# EAGLE design babyGroot (EAGLE 8.2.0)
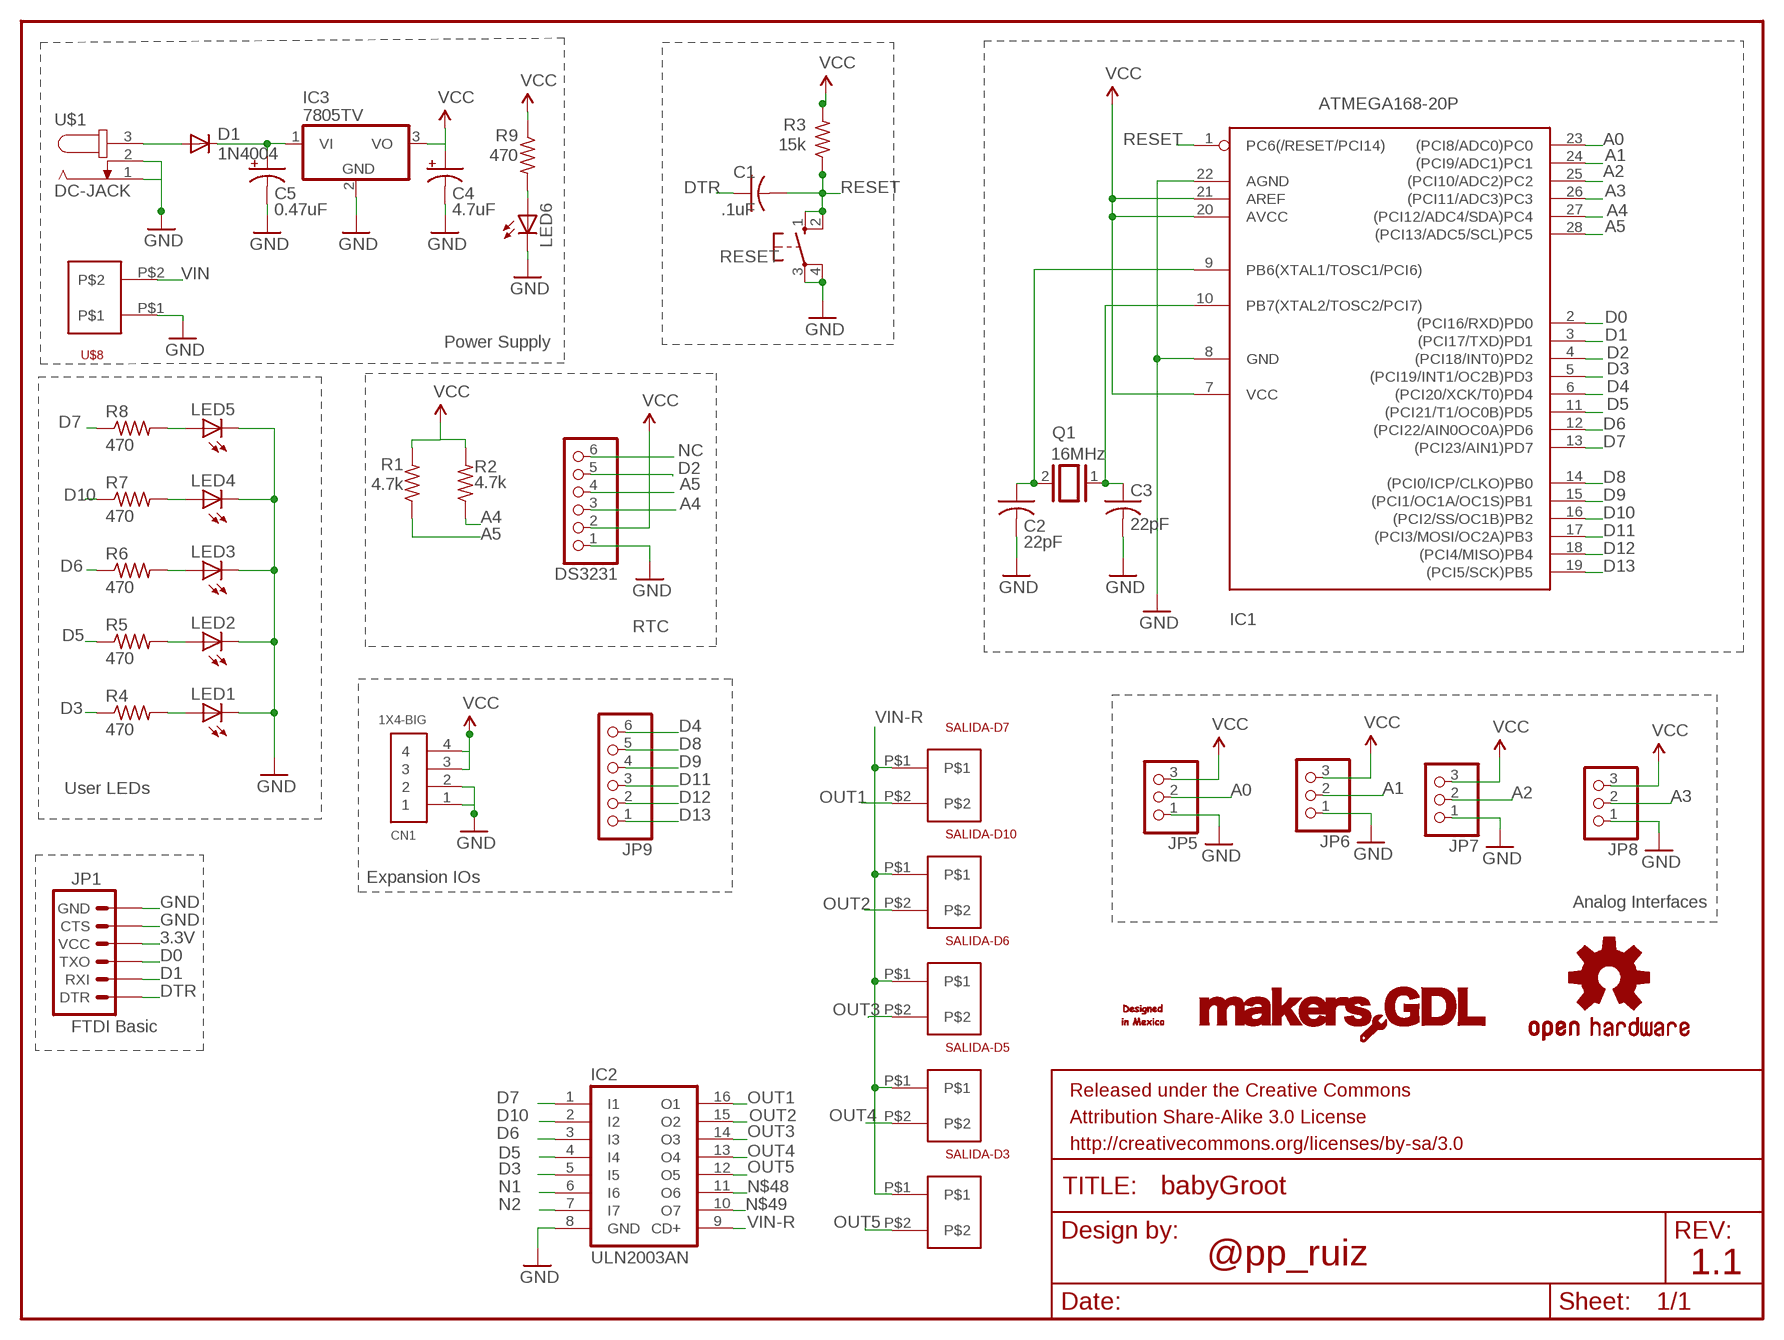
[diagram p0: schematic, sheet 1]

## Parts
C1  .1uF  C-US025-024X044  [C025-024X044]
C2  22pF  C-US025-024X044  [C025-024X044]
C3  22pF  C-US025-024X044  [C025-024X044]
C4  4.7uF  CPOL-USE2,5-6E  [E2,5-6E]
C5  0.47uF  CPOL-USE2,5-6E  [E2,5-6E]
CN1  1X4-BIG  [1X04-BIG]
D1  1N4004  [DO41-10]
DS3231  PINHD-1X6  [1X06]
FRAME1  FRAME-LETTER  [CREATIVE_COMMONS]
IC1  ATMEGA168-20P  [DIL28-3]
IC2  ULN2003AN  [DIL16]
IC3  7805TV  [TO220V]
JP1  FTDI Basic  ARDUINO_SERIAL_PROGRAMPTH  [1X06]
JP5  PINHD-1X3  [1X03]
JP6  PINHD-1X3  [1X03]
JP7  PINHD-1X3  [1X03]
JP8  PINHD-1X3  [1X03]
JP9  PINHD-1X6  [1X06]
LED1  LED3MM  [LED3MM]
LED2  LED3MM  [LED3MM]
LED3  LED3MM  [LED3MM]
LED4  LED3MM  [LED3MM]
LED5  LED3MM  [LED3MM]
LED6  LED3MM  [LED3MM]
Q1  16MHz  XTAL/S  [QS]
R1  4.7k  R-US_0204/2V  [0204V]
R2  4.7k  R-US_0204/2V  [0204V]
R3  15k  R-US_0204/2V  [0204V]
R4  470  R-US_0204/2V  [0204V]
R5  470  R-US_0204/2V  [0204V]
R6  470  R-US_0204/2V  [0204V]
R7  470  R-US_0204/2V  [0204V]
R8  470  R-US_0204/2V  [0204V]
R9  470  R-US_0204/2V  [0204V]
RESET  10-XX  [B3F-10XX]
SALIDA-D3  2POSHEADER-0.5MM  [2PIN-0.5MM]
SALIDA-D5  2POSHEADER-0.5MM  [2PIN-0.5MM]
SALIDA-D6  2POSHEADER-0.5MM  [2PIN-0.5MM]
SALIDA-D7  2POSHEADER-0.5MM  [2PIN-0.5MM]
SALIDA-D10  2POSHEADER-0.5MM  [2PIN-0.5MM]
U$1  DC-JACK  [SPC4078]
U$2  MAKERSGDLLOGO-SMALL  [MAKERSGGL-SMALL]
U$3  OSHW-LOGOS  [OSHW-LOGO-S]
U$4  MAKERSGDLLOGO-SMALL  [MAKERSGGL-SMALL]
U$5  OSHW-LOGOS  [OSHW-LOGO-S]
U$6  DESIGNEDMEXICO  [DESIGNEDMEXICO]
U$8  2POSHEADER-0.5MM  [2PIN-0.5MM]

## Nets
3.3V: C4.+ CN1.3 CN1.4 DS3231.2 IC1.7(VCC) IC1.20(AVCC) IC1.21(AREF) IC3.3(VO) JP1.4(VCC) JP5.3 JP6.3 JP7.3 JP8.3 R1.2 R2.2 R3.2 R9.1 ; supply symbol labelled VCC
A0: IC1.23((PCI8/ADC0)PC0) JP5.2
A1: IC1.24((PCI9/ADC1)PC1) JP6.2
A2: IC1.25((PCI10/ADC2)PC2) JP7.2
A3: IC1.26((PCI11/ADC3)PC3) JP8.2
A4: DS3231.3 IC1.27((PCI12/ADC4/SDA)PC4) R2.1
A5: DS3231.4 IC1.28((PCI13/ADC5/SCL)PC5) R1.1
D0: IC1.2((PCI16/RXD)PD0) JP1.3(TXO)
D1: IC1.3((PCI17/TXD)PD1) JP1.2(RXI)
D2: DS3231.5 IC1.4((PCI18/INT0)PD2)
D3: IC1.5((PCI19/INT1/OC2B)PD3) IC2.5(I5) R4.1
D4: IC1.6((PCI20/XCK/T0)PD4) JP9.6
D5: IC1.11((PCI21/T1/OC0B)PD5) IC2.4(I4) R5.1
D6: IC1.12((PCI22/AIN0OC0A)PD6) IC2.3(I3) R6.1
D7: IC1.13((PCI23/AIN1)PD7) IC2.1(I1) R8.1
D8: IC1.14((PCI0/ICP/CLKO)PB0) JP9.5
D9: IC1.15((PCI1/OC1A/OC1S)PB1) JP9.4
D10: IC1.16((PCI2/SS/OC1B)PB2) IC2.2(I2) R7.1
D11: IC1.17((PCI3/MOSI/OC2A)PB3) JP9.3
D12: IC1.18((PCI4/MISO)PB4) JP9.2
D13: IC1.19((PCI5/SCK)PB5) JP9.1
DTR: C1.1 JP1.1(DTR)
GND: C2.2 C3.2 C4.- C5.- CN1.1 CN1.2 DS3231.1 IC1.8(GND) IC1.22(AGND) IC2.8(GND) IC3.2(GND) JP1.5(CTS) JP1.6(GND) JP5.1 JP6.1 JP7.1 JP8.1 LED1.K(C) LED2.K(C) LED3.K(C) LED4.K(C) LED5.K(C) LED6.K(C) RESET.3(P) RESET.4(P1) U$1.1 U$1.2 U$8.P$1
N1: IC2.6(I6)
N2: IC2.7(I7)
N$1: C2.1 IC1.9(PB6(XTAL1/TOSC1/PCI6)) Q1.2
N$2: C3.1 IC1.10(PB7(XTAL2/TOSC2/PCI7)) Q1.1
N$3: LED6.A R9.2
N$5: LED5.A R8.2
N$8: LED4.A R7.2
N$10: LED3.A R6.2
N$12: LED2.A R5.2
N$14: LED1.A R4.2
N$48: IC2.11(O6)
N$49: IC2.10(O7)
NC: DS3231.6
OUT1: IC2.16(O1) SALIDA-D7.P$2
OUT2: IC2.15(O2) SALIDA-D10.P$2
OUT3: IC2.14(O3) SALIDA-D6.P$2
OUT4: IC2.13(O4) SALIDA-D5.P$2
OUT5: IC2.12(O5) SALIDA-D3.P$2
RESET: C1.2 IC1.1(PC6(/RESET/PCI14)) R3.1 RESET.1(S) RESET.2(S1)
VIN: D1.A U$1.3 U$8.P$2
VIN-R: C5.+ D1.C IC2.9(CD+) IC3.1(VI) SALIDA-D3.P$1 SALIDA-D5.P$1 SALIDA-D6.P$1 SALIDA-D7.P$1 SALIDA-D10.P$1

## Notes on the sheet
- Power Supply
- RTC
- User LEDs
- Expansion IOs
- Analog Interfaces
- @pp_ruiz | 1.1

## Library data of the parts
C1-C3 = adafruit:C-US: CAPACITOR, American symbol
C4 C5 = adafruit:CPOL-US: POLARIZED CAPACITOR, American symbol
CN1 = adafruit:1X4: 4-pin connector
D1 = adafruit:1N4004: DIODE General purpose 1N400x type rectifier (With bigger pads) http://www.ladyada.net/library/pcb/eaglelibrary.html
DS3231 JP9 = adafruit:PINHD-1X6: PIN HEADER
FRAME1 = SparkFun-Aesthetics:FRAME-LETTER: Schematic Frame Standard 8.5x11 US Letter frame
IC1 = adafruit:ATMEGA168*P: MICROCONTROLLER 16 kBytes FLASH 1 kBytes SRAM 512 Bytes EEPROM USART 8-channel 10 bit ADC
IC2 = uln-udn:ULN2003A: DRIVER ARRAY
IC3 = linear:78*: Positive VOLTAGE REGULATOR Source: http://cache.national.com/ds/LM/LM78L05.pdf http://www.fairchildsemi.com/ds/LM/LM7805.pdf
JP1 = SparkFun:ARDUINO_SERIAL_PROGRAM
JP5-JP8 = adafruit:PINHD-1X3: PIN HEADER
LED1-LED6 = adafruit:LED: LED OSRAM: - CHIPLED LG R971, LG N971, LY N971, LG Q971, LY Q971, LO R971, LY R971 LH N974, LH R974 LS Q976, LO Q976, LY Q976 LO Q996 - Hyper CHIPLED LW Q18S LB Q993, LB Q99A, LB R99A - SideLED LS A670, LO A670, LY A670, LG A670, LP A670 LB A673, LV A673, LT A673, LW A673 LH A674 LY A675 LS A676, LA A676, LO A676, LY A676, LW A676 LS A679, LY A679, LG A679 - Hyper Micro SIDELED® LS Y876, LA Y876, LO Y876, LY Y876 LT Y87S - SmartLED LW L88C, LW L88S LB L89C, LB L89S, LG L890 LS L89K, LO L89K, LY L89K LS L896, LA L896, LO L896, LY L896 - TOPLED LS T670, LO T670, LY T670, LG T670, LP T670 LSG T670, LSP T670, LSY T670, LOP T670, LYG T670 LG T671, LOG T671, LSG T671 LB T673, LV T673, LT T673, LW T673 LH T674 LS T676, LA T676, LO T676, LY T676, LB T676, LH T676, LSB T676, LW T676 LB T67C, LV T67C, LT T67C, LS T67K, LO T67K, LY T67K, LW E67C LS E67B, LA E67B, LO E67B, LY E67B, LB E67C, LV E67C, LT E67C LW T67C LS T679, LY T679, LG T679 LS T770, LO T770, LY T770, LG T770, LP T770 LB T773, LV T773, LT T773, LW T773 LH T774 LS E675, LA E675, LY E675, LS T675 LS T776, LA T776, LO T776, LY T776, LB T776 LHGB T686 LT T68C, LB T68C - Hyper Mini TOPLED® LB M676 - Mini TOPLED Santana® LG M470 LS M47K, LO M47K, LY M47K Source: http://www.osram.convergy.de/
Q1 = special:XTAL/S: CRYSTAL
R1-R9 = adafruit:R-US_: RESISTOR, American symbol
RESET = switch-omron:10-XX: OMRON SWITCH; MPN: B3F-1000; OC_FARNELL: 176432; OC_NEWARK: 36M3542
SALIDA-D3 SALIDA-D5-SALIDA-D7 SALIDA-D10 U$8 = StarlightMX:2POSHEADER-0.5MM
U$1 = StarlightMX:DC-JACK
U$2 U$4 = StarlightMX:MAKERSGDLLOGO-SMALL
U$3 U$5 = SparkFun:OSHW-LOGO: Open Source Hardware Logo This logo indicates the piece of hardware it is found on incorporates a OSHW license and/or adheres to the definition of open source hardware found here: http://freedomdefined.org/OSHW
U$6 = StarlightMX:DESIGNEDMEXICO

## Net classes
1 vcc: width 0.254 mm

## Board
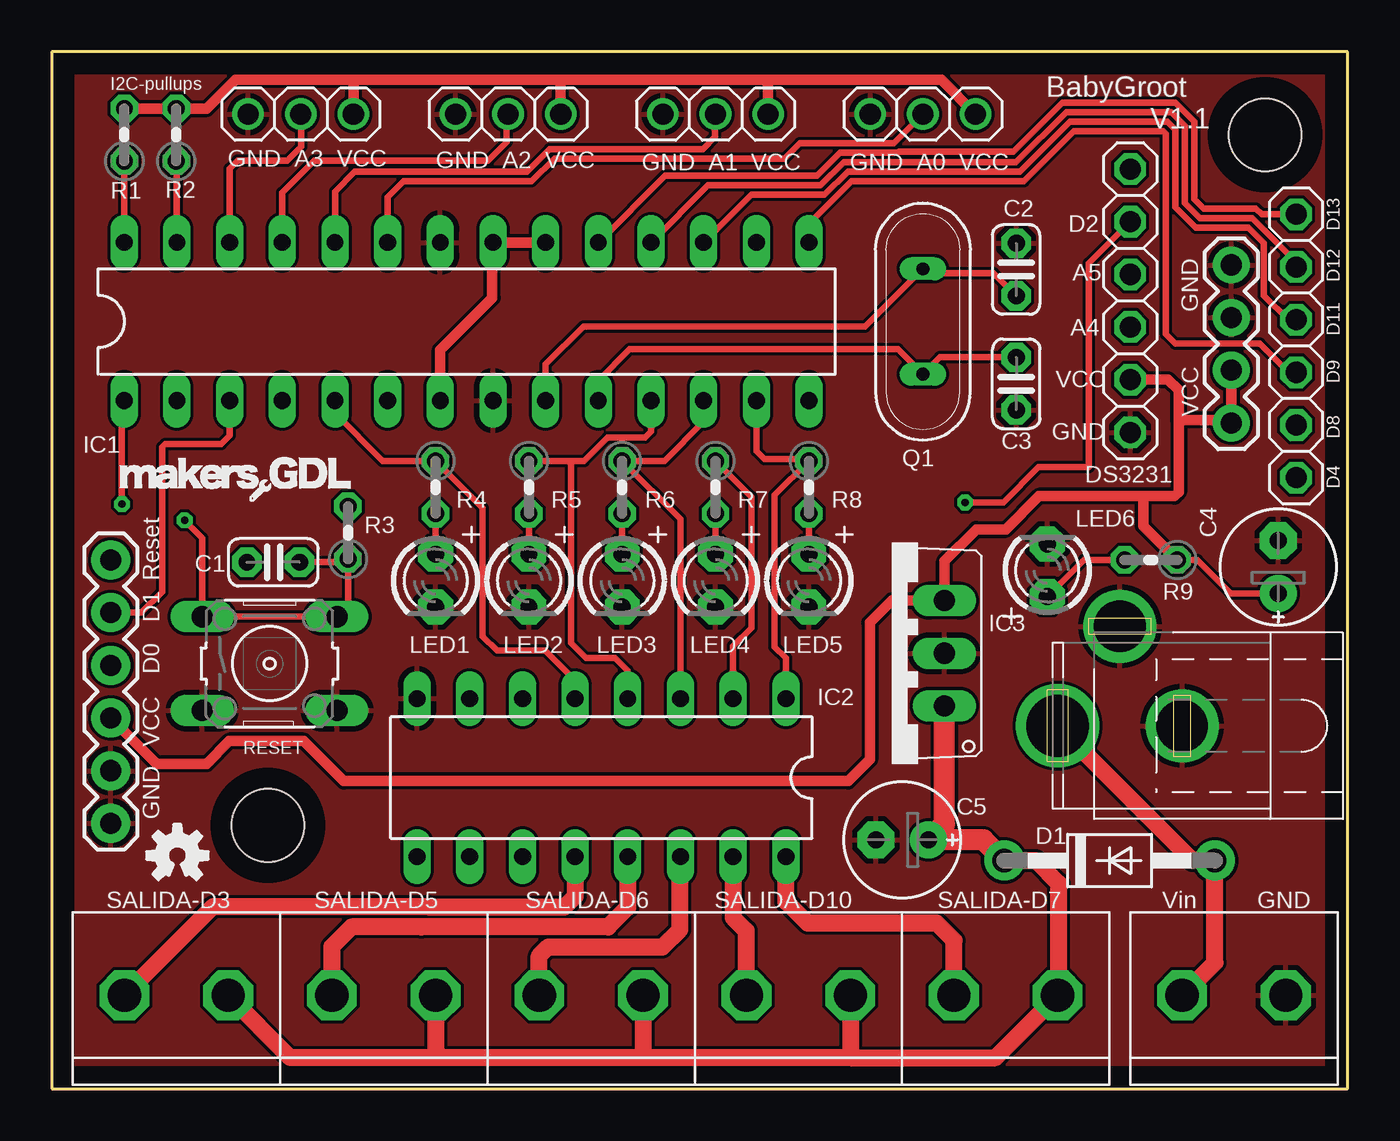
[diagram p1: board, top side]
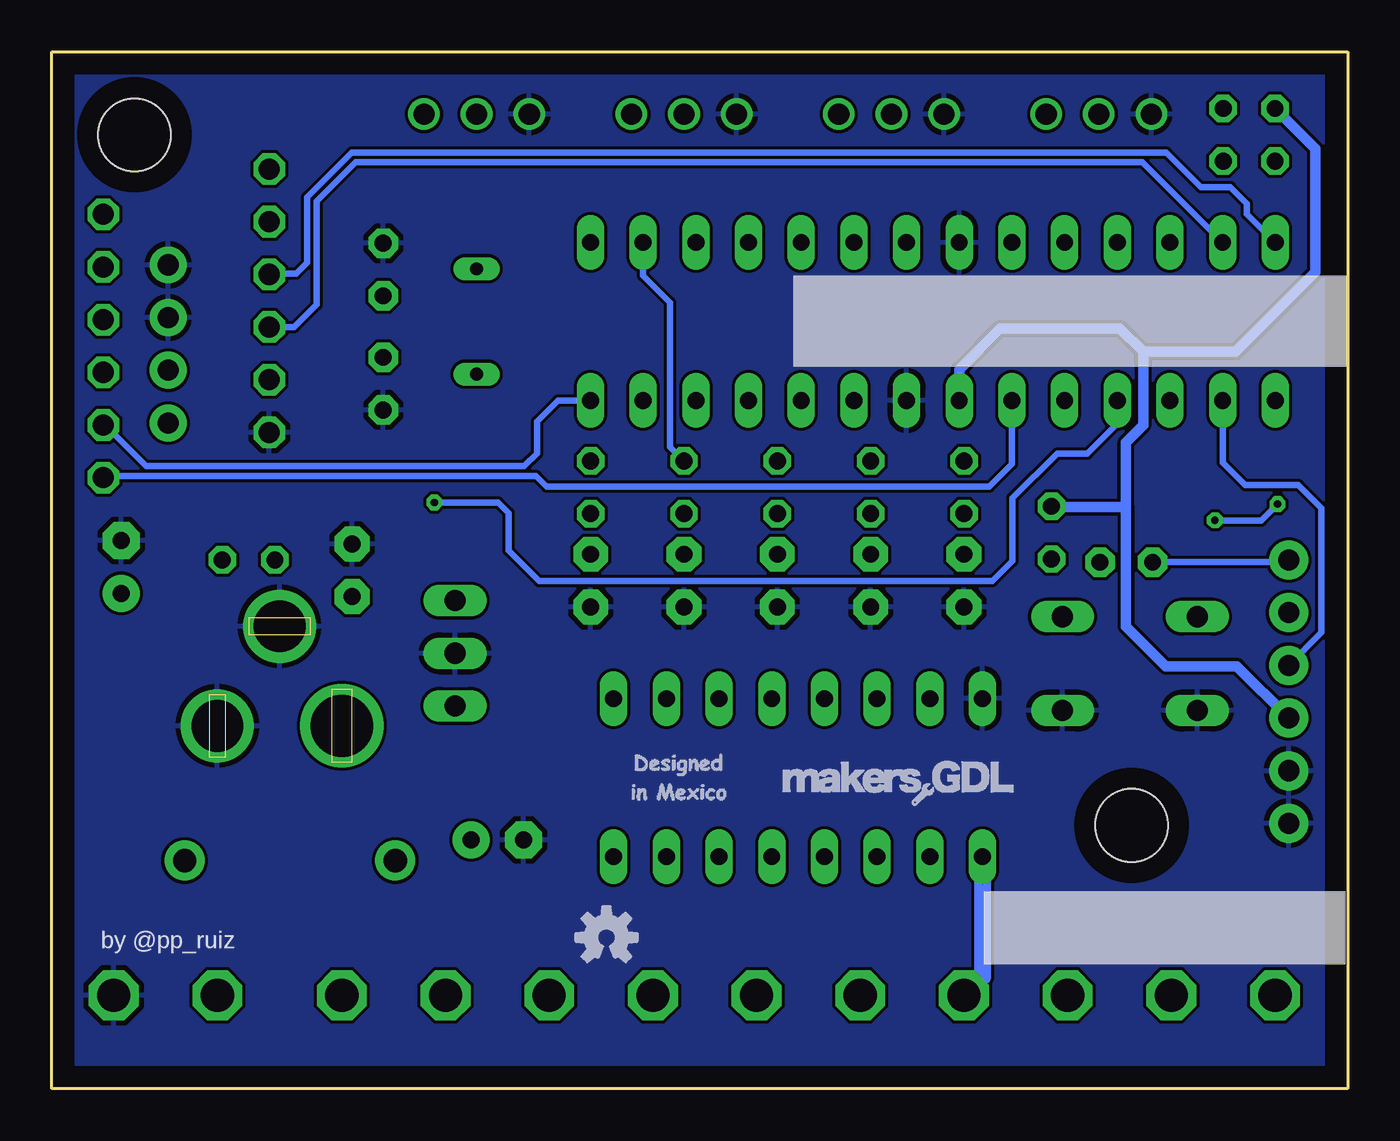
[diagram p2: board, bottom side, seen from below]

Size 62.48 x 50 mm. Coordinates in mm from the lower left corner, seen from the top.
Outline: 0,0 62.48,0 62.48,50 0,50 0,0
Copper layers (1*16): Top 0.035mm / dielectric 1.5mm / Bottom 0.035mm
Design rules "default": minimum track width 6mil, minimum drill 0.35mm, track to track 6mil, track to pad 6mil, pad to pad 6mil, via to via 6mil, smd to smd 6mil, copper to edge 40mil, drill to drill 6mil, minimum pad ring 10mil, minimum via ring 8mil, stop-mask expansion 4mil, vias tented up to drill 0mil, thermal gap 10mil
Holes 3.5 mm at 10.41,12.7 58.5,46

### Footprints (pad centres in the part's own frame; a part is rotated, then mirrored left to right if it is on the bottom)
C025-024X044 = drill 0.813 pad 1.422 octagon: 1 -1.27,0; 2 1.27,0
E2,5-6E = drill 0.813 pad 1.778: + -1.27,0 | drill 0.813 pad 1.778 octagon: - 1.27,0
1X04-BIG = drill 1.016 pad 1.778: 1 -3.81,0; 2 -1.27,0; 3 1.27,0; 4 3.81,0
DO41-10 = drill 1.118 pad 1.93: A 5.08,0; C -5.08,0
1X06 = drill 1.016 octagon: 1 -6.35,0; 2 -3.81,0; 3 -1.27,0; 4 1.27,0; 5 3.81,0; 6 6.35,0
DIL28-3 = drill 0.813 long: 1 -16.51,-3.81; 2 -13.97,-3.81; 3 -11.43,-3.81; 4 -8.89,-3.81; 5 -6.35,-3.81; 6 -3.81,-3.81; 7 -1.27,-3.81; 8 1.27,-3.81; 9 3.81,-3.81; 10 6.35,-3.81; 11 8.89,-3.81; 12 11.43,-3.81; 13 13.97,-3.81; 14 16.51,-3.81; 15 16.51,3.81; 16 13.97,3.81; 17 11.43,3.81; 18 8.89,3.81; 19 6.35,3.81; 20 3.81,3.81; 21 1.27,3.81; 22 -1.27,3.81; 23 -3.81,3.81; 24 -6.35,3.81; 25 -8.89,3.81; 26 -11.43,3.81; 27 -13.97,3.81; 28 -16.51,3.81
DIL16 = drill 0.813 long: 1 -8.89,-3.81; 2 -6.35,-3.81; 3 -3.81,-3.81; 4 -1.27,-3.81; 5 1.27,-3.81; 6 3.81,-3.81; 7 6.35,-3.81; 8 8.89,-3.81; 9 8.89,3.81; 10 6.35,3.81; 11 3.81,3.81; 12 1.27,3.81; 13 -1.27,3.81; 14 -3.81,3.81; 15 -6.35,3.81; 16 -8.89,3.81
TO220V = drill 1.016 long: 1 -2.54,-2.54; 2 0,-2.54; 3 2.54,-2.54
1X06' = drill 1.016 pad 1.88: 1 0,0; 2 2.54,0; 3 5.08,0; 4 7.62,0; 5 10.16,0; 6 12.7,0
1X03 = drill 1.016: 1 -2.54,0; 2 0,0; 3 2.54,0
LED3MM = drill 0.813 pad 1.676 octagon: A -1.27,0; K 1.27,0
QS = drill 0.61 long: 1 -2.54,0; 2 2.54,0
0204V = drill 0.813 octagon: 1 -1.27,0; 2 1.27,0
B3F-10XX = drill 1.016 long: 1 -3.251,2.261; 2 3.251,2.261; 3 -3.251,-2.261; 4 3.251,-2.261
2PIN-0.5MM = drill 1.6 octagon: P$1 -2.5,0; P$2 2.5,0
SPC4078 = drill 2.5 pad 3.5: 1 -3,0; 2 0,-4.8 | drill 3 pad 4: 3 3,0

### Placement (x,y rotation side)
C1  10.68,25.39 0 top
C2  46.5,39.5 90 top
C3  46.5,34 270 top
C4  59.13,25.16 90 top
C5  41,12 180 top
CN1  56.87,35.92 270 top
D1  51,11 0 top
DS3231  52,38 90 top
FRAME1  64.29,32.49 0 top
IC1  20,37 0 top
IC2  26.5,15 180 top
IC3  40.5,21 90 top
JP1  FTDI Basic  [1X06']  2.84,25.5 270 top
JP5  42,47 0 top
JP6  32,47 0 top
JP7  22,47 0 top
JP8  12,47 0 top
JP9  60,35.81 270 top
LED1  18.5,24.5 270 top
LED2  23,24.5 270 top
LED3  27.5,24.5 270 top
LED4  32,24.5 270 top
LED5  36.5,24.5 270 top
LED6  48,25 90 top
Q1  42,37 90 top
R1  3.5,46 90 top
R2  6,46 90 top
R3  14.28,26.81 90 top
R4  18.5,29 270 top
R5  23,29 270 top
R6  27.5,29 270 top
R7  32,29 270 top
R8  36.5,29 270 top
R9  52.99,25.5 180 top
RESET  10.5,20.5 0 top
SALIDA-D3  6,4.5 180 top
SALIDA-D5  16,4.5 180 top
SALIDA-D6  26,4.5 180 top
SALIDA-D7  46,4.5 180 top
SALIDA-D10  36,4.5 180 top
U$1  51.5,17.5 180 top
U$2  22.1,14.86 0 bottom
U$3  6.05,11.25 0 top
U$4  8.43,29.51 0 top
U$5  35.74,7.29 0 bottom
U$6  32.44,14.81 0 bottom
U$8  57,4.5 180 top

### Tracks (layer width: path | path; a pad name or v marks a point on that pad's centre or on a via)
3.3V
  Top 0.305: R9.1 55.23,25.5 56.85,23.89 C4.+
  Top 0.508: IC1.7 18.73,35.62 21.23,38.12 21.23,40.77 IC1.21 IC1.20 | R1.2 R2.2 7.47,47.27 8.85,48.65 14.61,48.65 | 24.61,48.65 34.34,48.65 | 14.61,48.65 24.61,48.65 | 34.34,48.65 42.89,48.65 JP5.3 | JP6.3 34.54,48.45 34.34,48.65 | JP7.3 24.54,48.58 24.61,48.65 | JP8.3 14.54,48.59 14.61,48.65 | JP1.4 5.05,15.67 7.47,15.67 8.56,16.76 12.14,16.76 14.07,14.83 38.41,14.83 39.45,15.88 39.45,22.48 40.51,23.54 IC3.3 43.04,25.44 44.58,26.98 46,26.98 47.6,28.57 52.63,28.57 | R9.1 52.63,27.14 52.63,28.57 | 52.63,28.57 54.13,28.57 54.33,28.78 54.33,32.23 | DS3231.2 53.82,34.19 54.33,33.68 54.33,32.23 | 54.33,32.23 56.74,32.23 CN1.4 CN1.3
  Bottom 0.508: 9.86,35.53 9.86,32 10.69,31.17 10.69,28.04 | 9.86,35.53 10.97,36.65 16.76,36.65 18.73,34.69 IC1.7 | R1.2 1.55,45.32 1.55,39.37 5.38,35.53 9.86,35.53 | JP1.4 5.34,20.37 8.76,20.37 10.69,22.3 10.69,28.04 | R3.2 14.28,28.04 10.69,28.04
A0
  Top 0.305: IC1.23 16.19,42.99 16.97,43.76 23.14,43.76 24.23,44.86 35.33,44.86 36.07,45.59 40.59,45.59 JP5.2
A1
  Top 0.305: IC1.24 13.65,43.27 14.61,44.22 22.91,44.22 24,45.31 31.39,45.31 31.98,45.9 31.98,46.98 JP6.2
A2
  Top 0.305: IC1.25 11.11,43.22 12.65,44.76 21.03,44.76 21.92,45.64 21.92,46.92 JP7.2
A3
  Top 0.305: IC1.26 8.57,44.36 8.97,44.76 11.35,44.76 12.01,45.41 12.01,46.99 JP8.2
A4
  Top 0.305: IC1.27 6.03,44.7 R2.1
  Bottom 0.305: IC1.27 9.9,44.68 47.83,44.68 49.71,42.8 49.71,37.82 50.8,36.73 DS3231.3
A5
  Top 0.305: IC1.28 R1.1
  Bottom 0.305: IC1.28 4.85,42.17 4.85,42.67 5.66,43.48 7.09,43.48 8.74,45.14 48.02,45.14 50.16,42.99 50.16,39.83 50.7,39.29 51.98,39.29 DS3231.4
D0
  Bottom 0.305: IC1.2 6.02,30.2 4.93,29.11 2.39,29.11 1.27,27.99 1.27,21.99 JP1.3
D1
  Top 0.305: JP1.2 4.31,22.96 5.31,23.95 5.31,30.94 5.46,31.09 8.15,31.09 8.57,31.51 IC1.3
D2  (via drill 0.35)
  Top 0.305: v44.04,28.27 45.87,28.27 47.57,29.97 50.01,29.97 50.01,39.82 DS3231.5
  Bottom 0.305: IC1.4 11.11,32.07 12.55,30.63 13.99,30.63 16.15,28.47 16.15,25.45 17.12,24.49 38.99,24.49 40.46,25.96 40.46,27.76 40.97,28.27 v44.04,28.27
D3
  Top 0.305: IC1.5 13.65,32.58 15.95,30.28 R4.1 20.78,27.99 20.78,21.82 21.46,21.13 23.77,21.13 25.23,19.68 IC2.5
D4
  Bottom 0.305: IC1.6 16.19,30.11 17.27,29.03 38.63,29.03 39.14,29.54 59.92,29.54 JP9.6
D5
  Top 0.305: 24.89,30.27 R5.1 | 24.89,30.27 25.67,30.27 26.8,31.39 28.6,31.39 28.89,31.68 IC1.11 | IC2.4 27.77,20.16 27.15,20.78 25.76,20.78 25.04,21.49 25.04,30.12 24.89,30.27
D6
  Top 0.305: IC1.12 31.43,32.17 29.53,30.27 R6.1 30.31,27.46 IC2.3
D7
  Top 0.305: IC1.13 33.97,30.75 34.37,30.35 36.44,30.35 R8.1 34.85,28.62 34.85,21.31 35.39,20.77 IC2.1
D8
  Bottom 0.305: IC1.14 38.08,33.19 39.09,32.18 39.09,30.63 39.7,30.02 57.94,30.02 59.92,32 JP9.5
D9
  Top 0.305: IC1.15 36.51,41.71 38.57,43.76 46.87,43.76 49.28,46.18 53.6,46.18 53.72,46.05 53.72,36.4 54.18,35.94 58.24,35.94 59.64,34.54 JP9.4
D10
  Top 0.305: IC2.2 32.85,21.34 33.73,22.23 33.73,28.54 R7.1
  Bottom 0.305: R7.1 32.66,30.93 32.66,37.9 33.97,39.2 IC1.16
D11
  Top 0.305: IC1.17 33.72,43.1 37.26,43.1 38.38,44.22 46.68,44.22 49.1,46.63 53.79,46.63 54.18,46.24 54.18,42.52 55.17,41.53 57.68,41.53 58.45,40.77 58.45,38.25 59.61,37.08 JP9.3
D12
  Top 0.305: IC1.18 31.64,43.56 37.07,43.56 38.19,44.68 46.49,44.68 48.91,47.09 53.98,47.09 54.63,46.43 54.63,42.71 55.36,41.99 57.87,41.99 60,39.86 JP9.2
D13
  Top 0.305: IC1.19 29.56,44.02 36.88,44.02 38,45.14 40.78,45.14 40.83,45.19 46.35,45.19 48.72,47.55 54.16,47.55 55.09,46.62 55.09,42.9 55.55,42.44 58.06,42.44 58.34,42.16 JP9.1
DTR
  Bottom 0.305: JP1.1 2.95,25.39 C1.1
GND
  pour Bottom: -0.46,50.62 70.99,50.62 70.99,-1.07 -0.46,-1.07
  pour Top: -0.3,50.55 71.15,50.55 71.15,-1.14 -0.3,-1.14
N$1
  Top 0.305: 41.79,39.33 Q1.2 | 41.79,39.33 39.21,36.75 25.63,36.75 23.81,34.94 IC1.9 | C2.1 45.4,39.33 41.79,39.33
N$2
  Top 0.305: IC1.10 26.35,34.15 27.86,35.66 40.8,35.66 Q1.1 42.81,35.27 C3.1
N$3
  Top 0.305: LED6.A 49.77,25.5 R9.2
N$5
  Top 0.305: R8.2 LED5.A
N$8
  Top 0.305: R7.2 LED4.A
N$10
  Top 0.305: R6.2 LED3.A
N$12
  Top 0.305: R5.2 LED2.A
N$14
  Top 0.305: R4.2 LED1.A
OUT1
  Top 0.813: SALIDA-D7.P$2 43.5,7.15 42.67,7.98 36.45,7.98 35.39,9.04 IC2.16
OUT2
  Top 0.813: IC2.15 32.85,8.25 33.48,7.62 33.48,4.52 SALIDA-D10.P$2
OUT3
  Top 0.813: SALIDA-D6.P$2 23.5,6.41 23.93,6.83 29.44,6.83 30.28,7.67 30.28,11.16 IC2.14
OUT4
  Top 0.813: SALIDA-D5.P$2 13.5,6.84 14.45,7.8 17.8,7.8 | IC2.13 27.77,8.74 26.82,7.8 17.8,7.8 | 17.8,7.8 17.78,7.82
OUT5
  Top 0.813: SALIDA-D3.P$2 7.79,8.79 18.18,8.79 18.2,8.76 24.71,8.76 25.25,9.3 25.25,11.17 IC2.12
RESET  (via drill 0.35)
  Top 0.305: C1.2 14.28,25.39 R3.1 14.28,23.29 RESET.2 RESET.1 7.25,26.56 v6.4,27.41 | v3.38,28.19 3.38,33.08 IC1.1
  Bottom 0.305: v6.4,27.41 4.17,27.41 v3.38,28.19
VIN
  Top 0.813: U$8.P$2 56.08,6.08 D1.A 55,11 U$1.3
VIN-R
  Top 0.813: D1.C 47.45,11 48.56,9.88 48.56,4.57 SALIDA-D7.P$1 45.5,1.5 38.51,1.5 | SALIDA-D3.P$1 11.5,1.5 18.77,1.5 | 28.55,1.5 18.77,1.5 | 38.51,1.5 28.55,1.5 | SALIDA-D5.P$1 18.5,1.77 18.77,1.5 | SALIDA-D6.P$1 28.5,1.55 28.55,1.5 | SALIDA-D10.P$1 38.5,1.5 38.51,1.5
  Top 1.016: D1.C 44.92,12 C5.+ 43.04,12.77 IC3.1
  Bottom 0.813: IC2.9 17.61,5.39 SALIDA-D5.P$1

### Text on the board
tPlace: GND A3 VCC | GND A2 VCC | GND A1 VCC | GND A0 VCC
tNames: I2C-pullups | BabyGroot | V1.1 | D2 | D13 | A5 | D12 | GND | A4 | D11 | VCC | D9 | VCC | GND | D8 | D4 | Reset | D1 | D0 | VCC | GND | Vin | GND
bNames: by @pp_ruiz